# Altium schematic sheet Power.SchDoc
size A; SheetNumber: 2; SheetTotal: 4
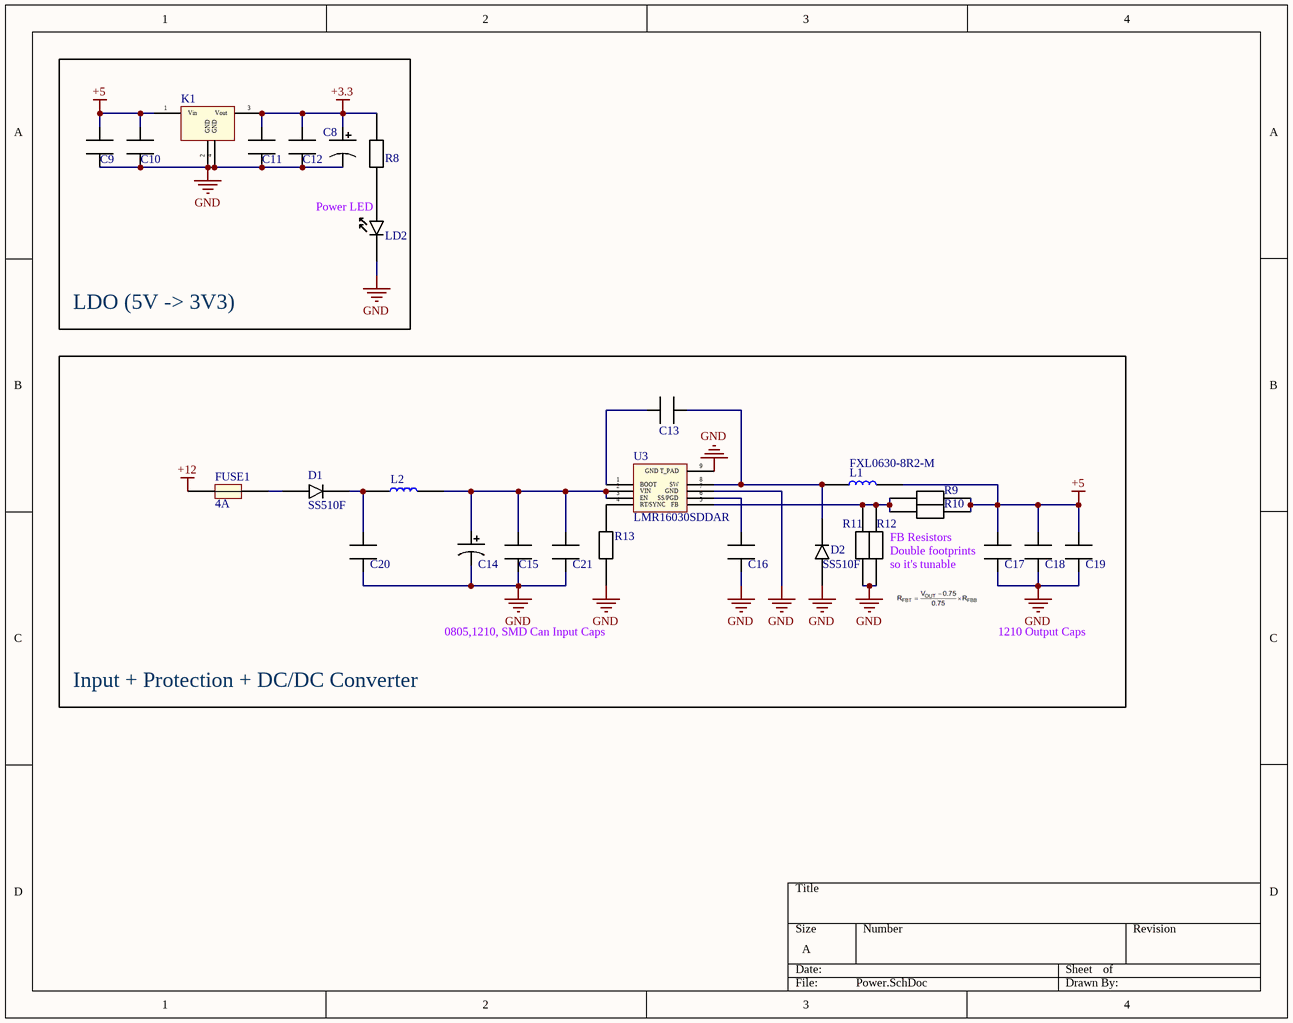
[diagram p0: Power.SchDoc]

## Parts
C8  10uf  [CAP_CAN_D5MM]  (value not drawn)
C9  1uF  [CAP_1206]  (value not drawn)
C10  100nF  [CAP_0805]  (value not drawn)
C11  100nF  [CAP_0805]  (value not drawn)
C12  1uF  [CAP_1206]  (value not drawn)
C13  100nF 50V  [CAP_0805]  (value not drawn)
C14  47uf 100v  [CAP_CAN_D10mm]  (value not drawn)
C15  10uF 100V  [CAP_1210]  (value not drawn)
C16  100nF 50V  [CAP_0805]  (value not drawn)
C17  CS3225X7R476K160NRL  [CAP_1210]  (value not drawn)
C18  CS3225X7R476K160NRL  [CAP_1210]  (value not drawn)
C19  CS3225X7R476K160NRL  [CAP_1210]  (value not drawn)
C20  100nF 100V  [CAP_0805]  (value not drawn)
C21  100nF 100V  [CAP_0805]  (value not drawn)
D1  SS510F  [SMAF]
D2  SS510F  [SMAF]
FUSE1  4A  [FUSE_1206]
K1  MIC39100-3.3WS  [SOT223-4]  (value not drawn)
L1  FXL0630-8R2-M  [IND_FXL06]
L2  10uH 1.2A  [IND_1210]  (value not drawn)
LD2  LED_0805  [LED_0805]  (value not drawn)
R8  10k  [RES_0805]  (value not drawn)
R9  10k  [RES_0805]  (value not drawn)
R10  NC  [RES_0805]  (value not drawn)
R11  2k  [RES_0805]  (value not drawn)
R12  15k  [RES_0805]  (value not drawn)
R13  10k  [RES_0805]  (value not drawn)
U3  LMR16030SDDAR  [SOIC8_T]

## Blocks framed on the sheet
LDO (5V -> 3V3): C8-C12 K1 LD2 R8
Input + Protection + DC/DC Converter: C13-C21 D1 D2 FUSE1 L1 L2 R9-R13 U3

## Nets
+3.3: C8.1 C11.2 C12.2 K1.3(Vout) R8.2
+5: C9.2 C10.2 C17.2 C18.2 C19.2 K1.1(Vin) L1.2 R9.2 R10.2
+12: FUSE1.1
GND: C8.2 C9.1 C10.1 C11.1 C12.1 C14.2 C15.1 C16.1 C17.1 C18.1 C19.1 C20.1 C21.1 D2.2 K1.2(GND) K1.4(GND) LD2.1 R11.2 R12.2 R13.1 U3.7(GND) U3.9(GND_T_PAD)
NetC13_1: C13.1 U3.1(BOOT)
NetC13_2: C13.2 D2.1 L1.1 U3.8(SW)
NetC14_1: C14.1 C15.2 C21.2 L2.2 U3.2(VIN) U3.3(EN)
NetC16_2: C16.2 U3.6(SS/PGD)
NetC20_2: C20.2 D1.1 L2.1
NetD1_2: D1.2 FUSE1.2
NetLD2_2: LD2.2 R8.1
NetR9_1: R9.1 R10.1 R11.1 R12.1 U3.5(FB)
NetR13_2: R13.2 U3.4(RT/SYNC)

## Notes on the sheet
- (near LD2) Power LED
- FB Resistors
- (near C17) Double footprints
- so it's tunable
- 0805,1210, SMD Can Input Caps
- 1210 Output Caps

## Library data of the parts
C8 = CAP_CAN_D5mm: SMD Can Capacitor; 5mm Diameter; note: any manufacturer; val: 10uf; sample link: https://www.lcsc.com/product-detail/C3357.html?s_z=n_10uF%2520SMD%2520Can%2520Capacitor%2520D5%2520RVT
C9 C12 = CAP_1206: note: any manufacturer; val: 1uF
C10 C11 C13 C16 C20 C21 = CAP_0805: note: any manufacturer
  C10 C11: val: 100nF
  C13 C16: val: 100nF 50V
  C20 C21: val: 100nF 100V
C14 = CAP_CAN_D10mm: SMD Can Capacitor; 10mm Diameter; note: Original; val: 47uf 100v; sample link: https://www.lcsc.com/product-detail/Aluminum-Electrolytic-span-style-background-color-ff0-Capacitors-span-SMD_ROQANG-RVT2A470M1010_C335988.html
C15 C17-C19 = CAP_1210: note: any manufacturer
  C15: val: 10uF 100V
  C17-C19: val: CS3225X7R476K160NRL; sample link: https://www.lcsc.com/product-detail/Multilayer-Ceramic-Capacitors-MLCC-SMD-SMT_Samwha-Capacitor-CS3225X7R476K160NRL_C5440143.html
D1 D2 = SS510F: 100V 850mV@5A 5A SMAF Schottky Diodes ROHS; note: any manufacturer; val: SS510F; sample link: https://www.lcsc.com/product-detail/Schottky-Diodes_XUMAO-SS510F_C22466253.html
FUSE1 = Fuse_1206: val: 4A; sample link: https://item.taobao.com/item.htm?abbucket=8&id=562837668942&ns=1&spm=a230r.1.14.1.30d440c1oWmyxt; note: https://item.taobao.com/item.htm?abbucket=8&id=562837668942&ns=1&spm=a230r.1.14.1.30d440c1oWmyxt
K1 = MIC39100_SOT223: LDO; / 2.25V -> 16V; / 1A Max; / Fixed Output - 1.8V, 2.5V, 3.3V, 5V; note: Original; val: MIC39100-3.3WS; sample link: https://www.lcsc.com/product-detail/Linear-Voltage-Regulators-span-style-background-color-ff0-LDO-span_MaxLinear-SPX3940AM3-L-3-3-TR_C48252.html
L1 = IND_FXL06: Precision Wire Wound Inductor, 2-Leads, Body 4,50x4,00mm, IPC Medium Density; note: original; sample link: https://www.lcsc.com/product-detail/span-style-background-color-ff0-Power-span-Inductors_cjiang-Changjiang-Microelectronics-Tech-FXL0630-8R2-M_C167222.html; val: FXL0630-8R2-M
L2 = IND_1210_Choke: Precision Wire Wound Inductor, 2-Leads, Body 4,50x4,00mm, IPC Medium Density; val: TDK TFM322512ALMA100MTAA; note: Original; sample link: https://www.lcsc.com/product-detail/C2047632.html
R8-R13 = RES_0805: note: any manufacturer
  R8 R9 R13: val: 10k
  R10: val: NC
  R11: val: 2k
  R12: val: 15k
U3 = TI LMR16030SDDAR: 60V 3A Step-Down Converter / 2.5MHz Buck Adjustable 1 SO-8-EP Voltage Regulators - DC DC Switching Regulators RoHS; note: original; val: LMR16030SDDAR; sample link: https://www.lcsc.com/product-detail/DC-DC-Converters_Texas-Instruments-LMR16030SDDAR_C136648.html